# Altium schematic sheet JETSON_V2.SchDoc
size D; SheetNumber: 11; SheetTotal: 15
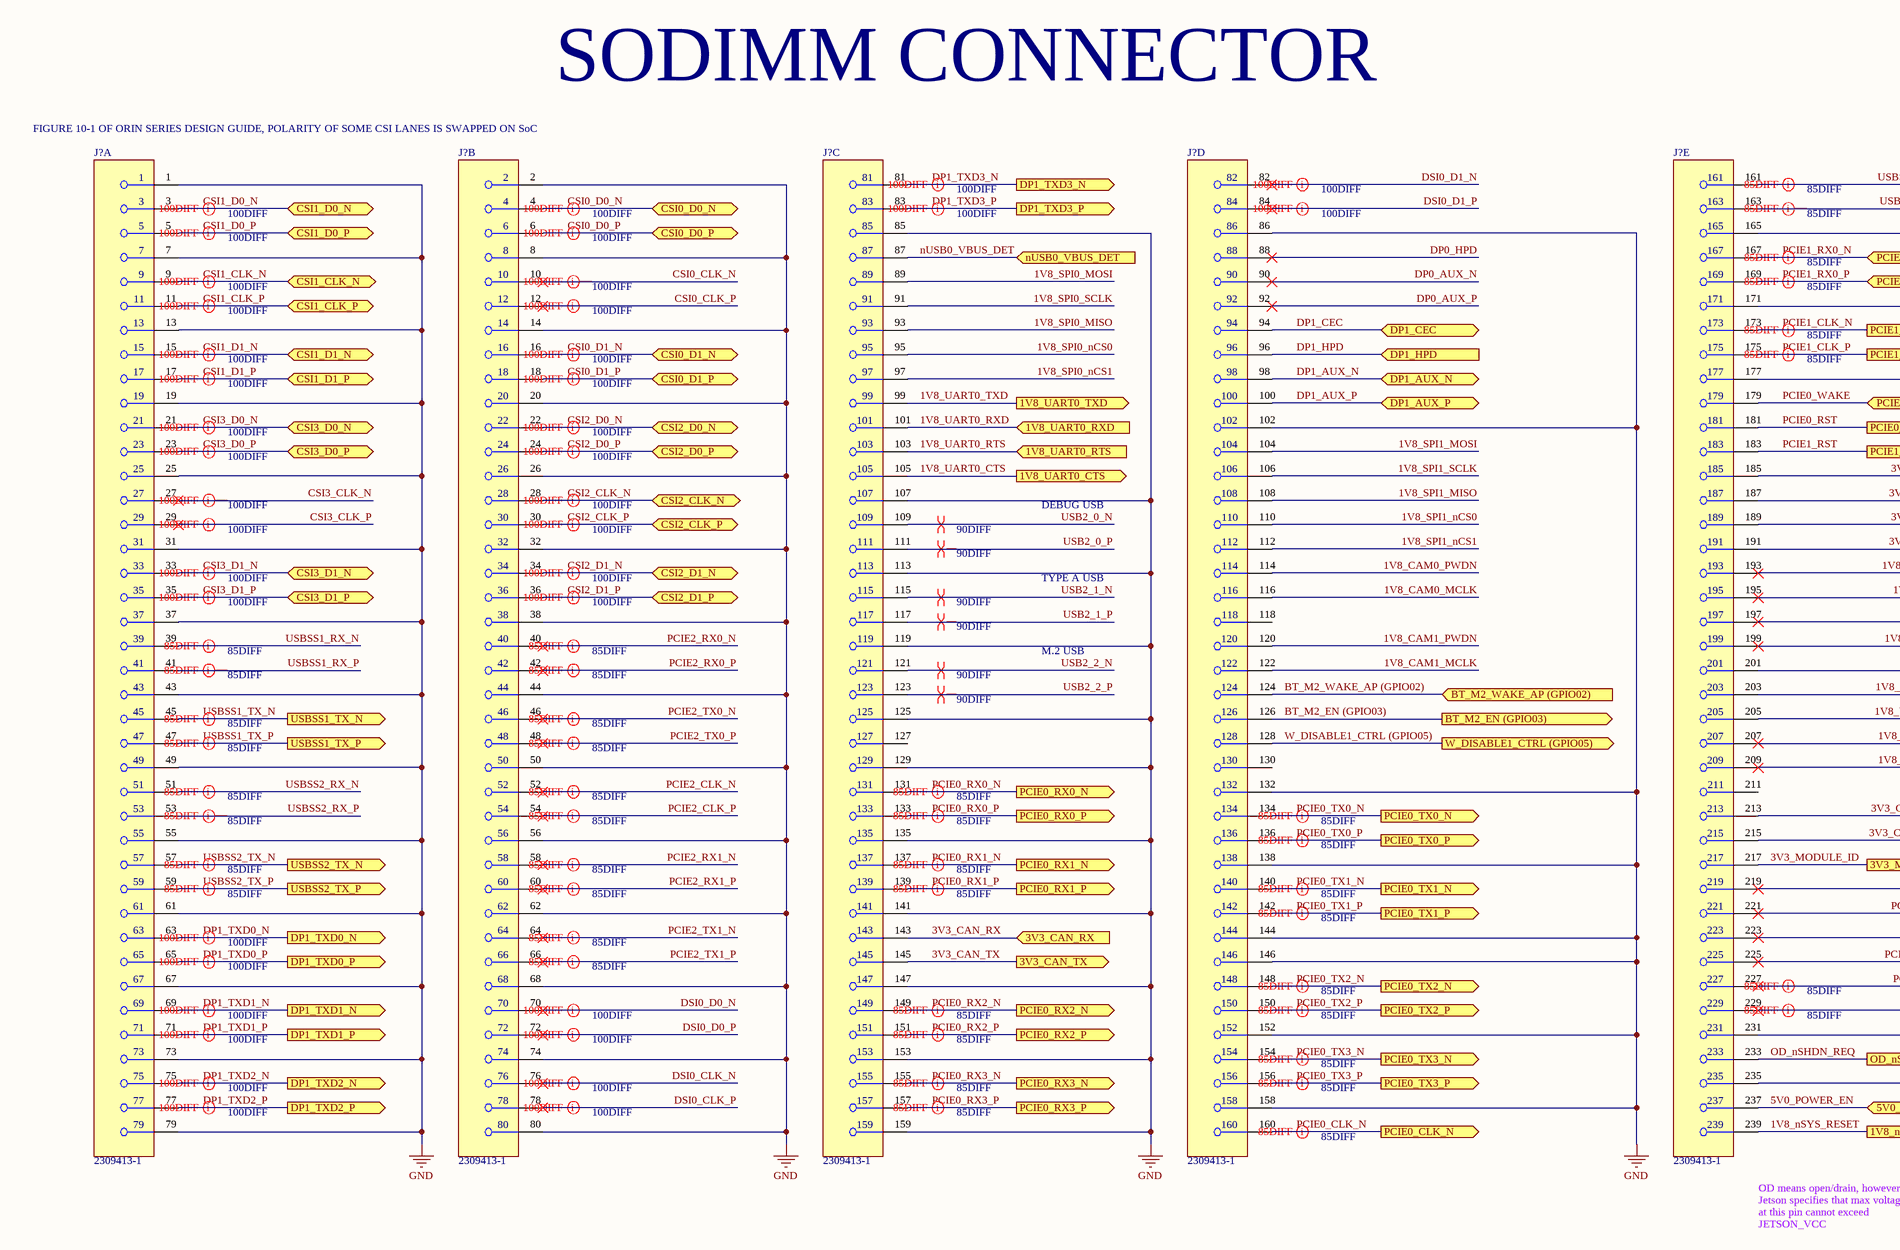
[diagram p0: JETSON_V2.SchDoc, top left]
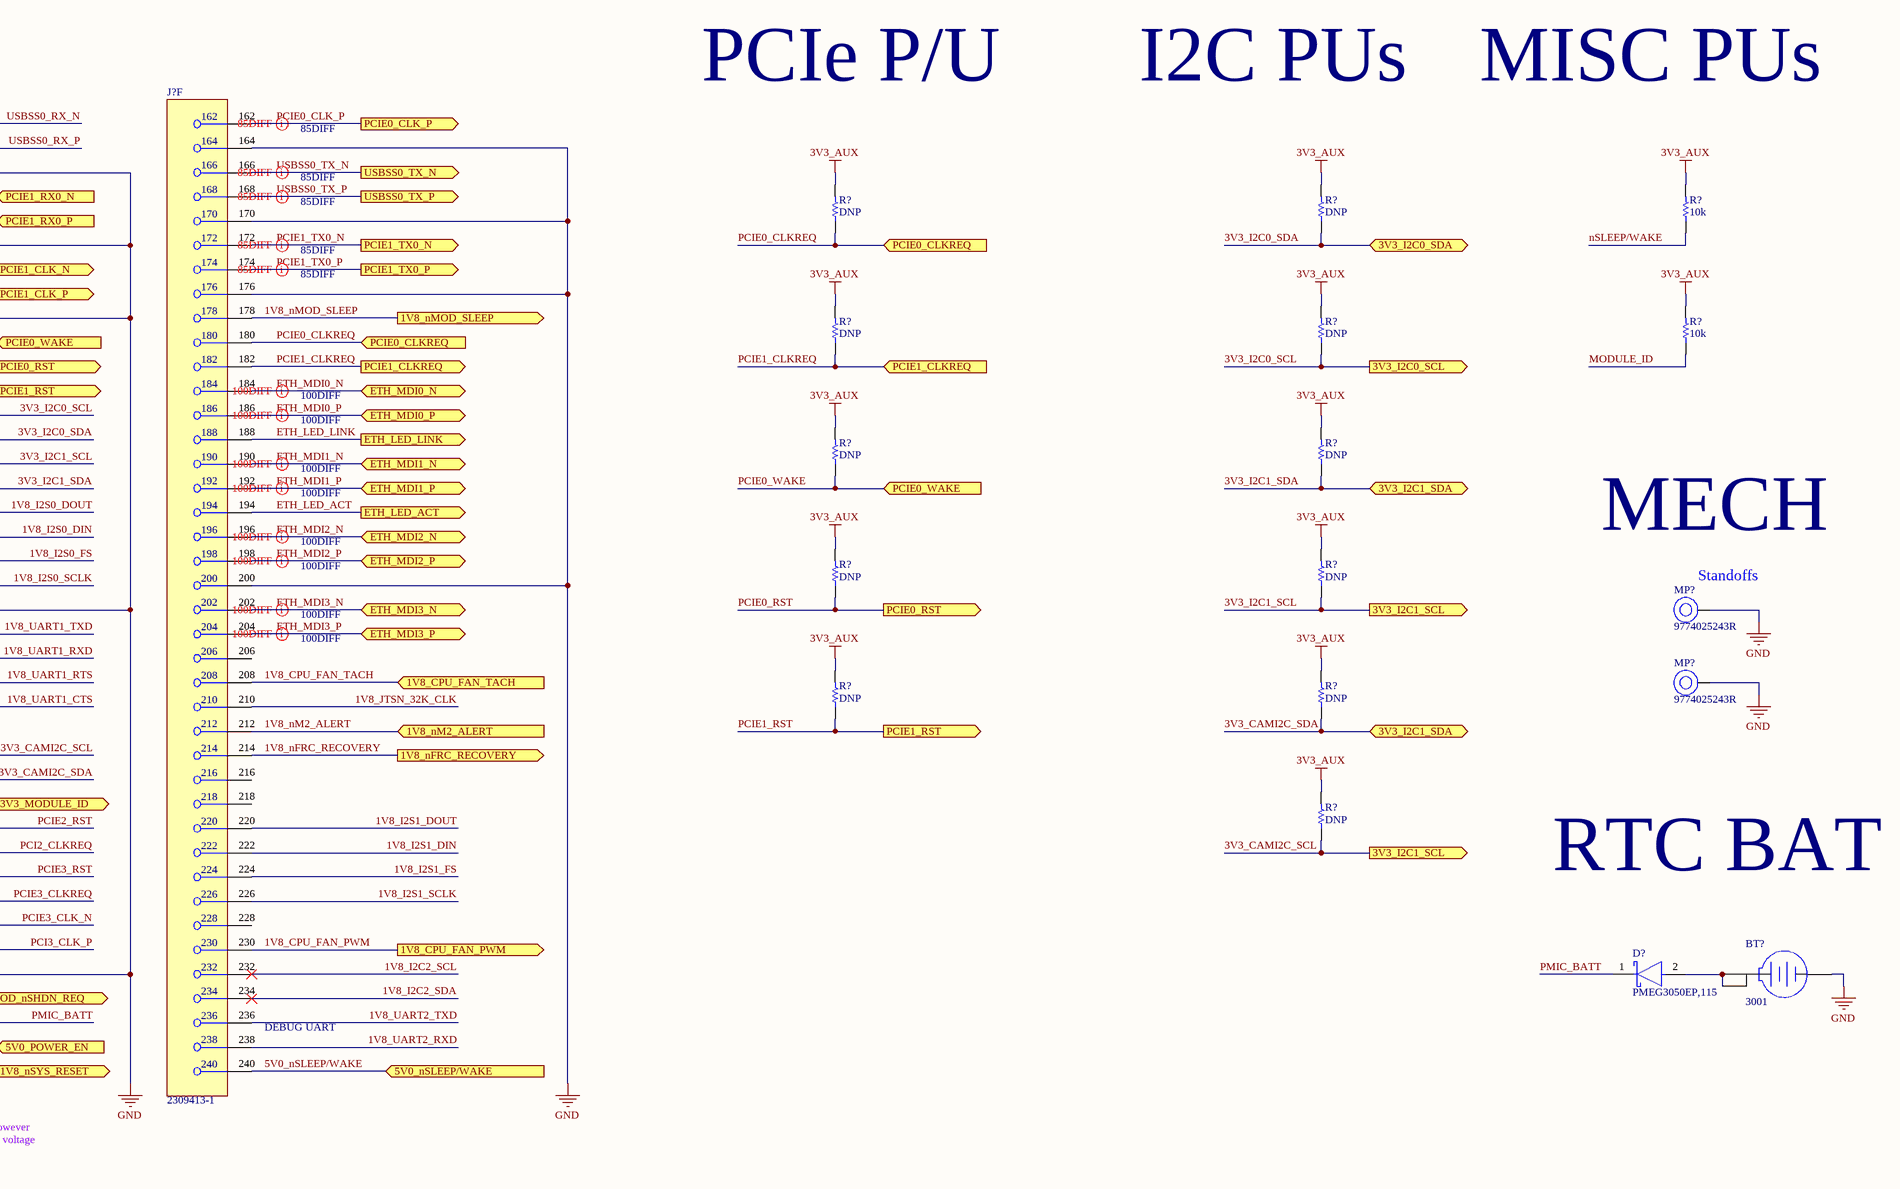
[diagram p1: JETSON_V2.SchDoc, top right]
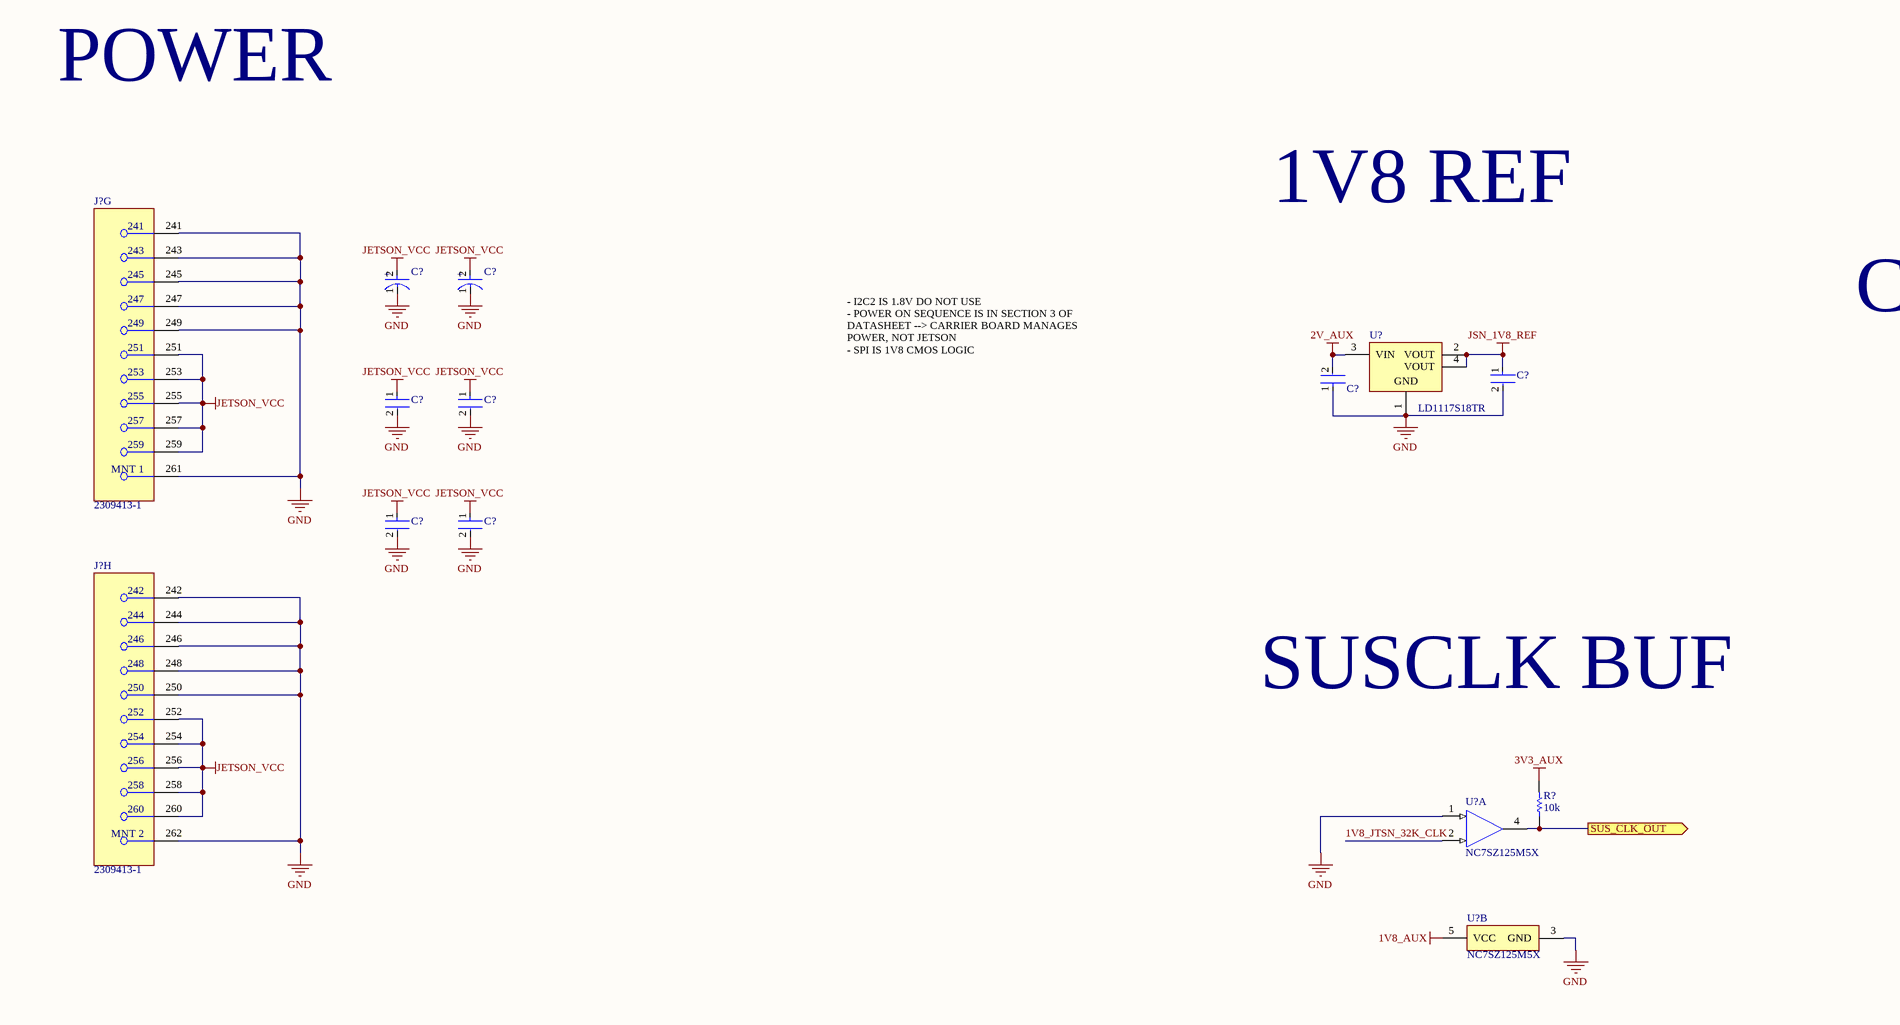
[diagram p2: JETSON_V2.SchDoc, bottom left]
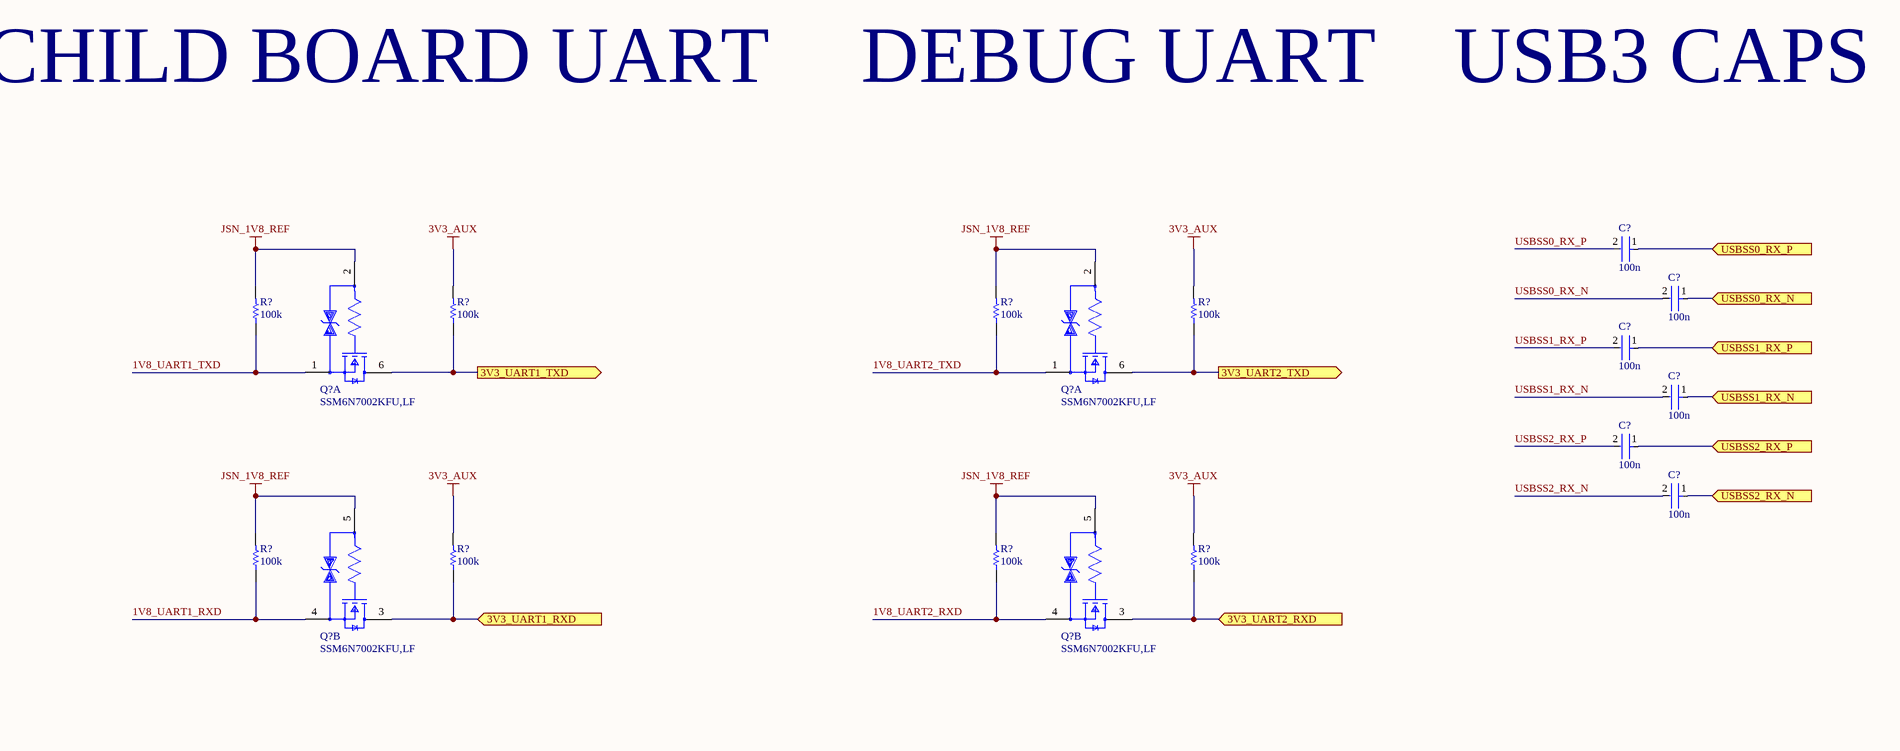
[diagram p3: JETSON_V2.SchDoc, bottom right]

## Parts
(Parts that share a designator on the sheet are numbered #1, #2 ... from top to bottom, then left to right.)
BT?  3001  [KSTN-3001_V]
C?#1  T491X107K025AT  [FP-T491X107K025AT-MFG]  (value not drawn)
C?#2  T491X107K025AT  [FP-T491X107K025AT-MFG]  (value not drawn)
C?#3  GRM188R60J106ME47D  [FP-GRM188-0_1-e0_2_0_55-IPC_A]  (value not drawn)
C?#4  12103D106KAT2A  [FP-1210-L_3_3_0_4-W_2_5_0-MFG]  (value not drawn)
C?#5  12103D106KAT2A  [FP-1210-L_3_3_0_4-W_2_5_0-MFG]  (value not drawn)
C?#6  C1005X7R1H104K050BB  [FP-C1005-050-0_05-IPC_C]  (value not drawn)
C?#7  100n  [FP-0402-L_1_0_0_05-W_0_5-IPC_A]
C?#8  12103D106KAT2A  [FP-1210-L_3_3_0_4-W_2_5_0-MFG]  (value not drawn)
C?#9  12103D106KAT2A  [FP-1210-L_3_3_0_4-W_2_5_0-MFG]  (value not drawn)
C?#10  100n  [FP-0402-L_1_0_0_05-W_0_5-IPC_A]
C?#11  100n  [FP-0402-L_1_0_0_05-W_0_5-IPC_A]
C?#12  100n  [FP-0402-L_1_0_0_05-W_0_5-IPC_A]
C?#13  100n  [FP-0402-L_1_0_0_05-W_0_5-IPC_A]
C?#14  100n  [FP-0402-L_1_0_0_05-W_0_5-IPC_A]
D?  PMEG3050EP,115  [FP-SOD128-MFG]
J?#1  2309413-1  [FP-2309413-1-MFG]  (part A of 8)
J?#2  2309413-1  [FP-2309413-1-MFG]  (part B of 8)
J?#3  2309413-1  [FP-2309413-1-MFG]  (part C of 8)
J?#4  2309413-1  [FP-2309413-1-MFG]  (part D of 8)
J?#5  2309413-1  [FP-2309413-1-MFG]  (part E of 8)
J?#6  2309413-1  [FP-2309413-1-MFG]  (part F of 8)
J?#7  2309413-1  [FP-2309413-1-MFG]  (part G of 8)
J?#8  2309413-1  [FP-2309413-1-MFG]  (part H of 8)
MP?#1  9774025243R  [9774025243]
MP?#2  9774025243R  [9774025243]
Q?#1  SSM6N7002KFU,LF  [FP-SSOP6-P-0_65A-MFG]  (part A of 2)
Q?#2  SSM6N7002KFU,LF  [FP-SSOP6-P-0_65A-MFG]  (part A of 2)
Q?#3  SSM6N7002KFU,LF  [FP-SSOP6-P-0_65A-MFG]  (part B of 2)
Q?#4  SSM6N7002KFU,LF  [FP-SSOP6-P-0_65A-MFG]  (part B of 2)
R?#1  DNP  [R0603B]
R?#2  DNP  [R0603B]
R?#3  10k  [R0603B]
R?#4  DNP  [R0603B]
R?#5  DNP  [R0603B]
R?#6  10k  [R0603B]
R?#7  DNP  [R0603B]
R?#8  DNP  [R0603B]
R?#9  DNP  [R0603B]
R?#10  DNP  [R0603B]
R?#11  DNP  [R0603B]
R?#12  DNP  [R0603B]
R?#13  DNP  [R0603B]
R?#14  100k  [R0603B]
R?#15  100k  [R0603B]
R?#16  100k  [R0603B]
R?#17  100k  [R0603B]
R?#18  100k  [R0603B]
R?#19  100k  [R0603B]
R?#20  100k  [R0603B]
R?#21  100k  [R0603B]
R?#22  10k  [R0603B]
U?#1  LD1117S18TR  [SOT-223_M]
U?#2  NC7SZ125M5X  [FAIR-SOT23-5_V]  (part A of 2)
U?#3  NC7SZ125M5X  [FAIR-SOT23-5_V]  (part B of 2)

## Ports
1V8_CPU_FAN_PWM (out), 1V8_CPU_FAN_TACH (in), 1V8_nFRC_RECOVERY (out), 1V8_nM2_ALERT (in), 1V8_nMOD_SLEEP (out), 1V8_nSYS_RESET (out), 1V8_UART0_CTS (out), 1V8_UART0_RTS (in), 1V8_UART0_RXD (in), 1V8_UART0_TXD (out), 3V3_CAN_RX (in), 3V3_CAN_TX (out), 3V3_I2C0_SCL (out), 3V3_I2C0_SDA (bidir), 3V3_I2C1_SCL (out), 3V3_I2C1_SDA (bidir), 3V3_MODULE_ID (out), 3V3_UART1_RXD (in), 3V3_UART1_TXD (out), 3V3_UART2_RXD (in), 3V3_UART2_TXD (out), 5V0_nSLEEP/WAKE (in), 5V0_POWER_EN (in), BT_M2_EN (GPIO03) (out), BT_M2_WAKE_AP (GPIO02) (in), CSI0_D0_N (bidir), CSI0_D0_P (bidir), CSI0_D1_N (bidir), CSI0_D1_P (bidir), CSI1_CLK_N (bidir), CSI1_CLK_P (bidir), CSI1_D0_N (bidir), CSI1_D0_P (bidir), CSI1_D1_N (bidir), CSI1_D1_P (bidir), CSI2_CLK_N (bidir), CSI2_CLK_P (bidir), CSI2_D0_N (bidir), CSI2_D0_P (bidir), CSI2_D1_N (bidir), CSI2_D1_P (bidir), CSI3_D0_N (bidir), CSI3_D0_P (bidir), CSI3_D1_N (bidir), CSI3_D1_P (bidir), DP1_AUX_N (bidir), DP1_AUX_P (bidir), DP1_CEC (bidir), DP1_HPD (in), DP1_TXD0_N (out), DP1_TXD0_P (out), DP1_TXD1_N (out), DP1_TXD1_P (out), DP1_TXD2_N (out), DP1_TXD2_P (out), DP1_TXD3_N (out), DP1_TXD3_P (out), ETH_LED_ACT (out), ETH_LED_LINK (out), ETH_MDI0_N (bidir), ETH_MDI0_P (bidir), ETH_MDI1_N (bidir), ETH_MDI1_P (bidir), ETH_MDI2_N (bidir), ETH_MDI2_P (bidir), ETH_MDI3_N (bidir), ETH_MDI3_P (bidir), nUSB0_VBUS_DET (in), OD_nSHDN_REQ (out), PCIE0_CLK_N (out), PCIE0_CLK_P (out), PCIE0_CLKREQ (in), PCIE0_RST (out), PCIE0_RX0_N (out), PCIE0_RX0_P (out), PCIE0_RX1_N (out), PCIE0_RX1_P (out), PCIE0_RX2_N (out), PCIE0_RX2_P (out), PCIE0_RX3_N (out), PCIE0_RX3_P (out), PCIE0_TX0_N (out), PCIE0_TX0_P (out), PCIE0_TX1_N (out), PCIE0_TX1_P (out), PCIE0_TX2_N (out), PCIE0_TX2_P (out), PCIE0_TX3_N (out), PCIE0_TX3_P (out), PCIE0_WAKE (in), PCIE1_CLK_N (out), PCIE1_CLK_P (out), PCIE1_CLKREQ (in), PCIE1_CLKREQ (out), PCIE1_RST (out), PCIE1_RX0_N (in), PCIE1_RX0_P (in), PCIE1_TX0_N (out), PCIE1_TX0_P (out), SUS_CLK_OUT (out), USBSS0_RX_N (in), USBSS0_RX_P (in), USBSS0_TX_N (out), USBSS0_TX_P (out), USBSS1_RX_N (in), USBSS1_RX_P (in), USBSS1_TX_N (out), USBSS1_TX_P (out), USBSS2_RX_N (in), USBSS2_RX_P (in), USBSS2_TX_N (out), USBSS2_TX_P (out), W_DISABLE1_CTRL (GPIO05) (out)

## Nets
1V8_AUX: U?#3.5(VCC)
2V_AUX: C?#6.2 U?#1.3(VIN)
3V3_AUX: R?#1.2 R?#2.2 R?#3.2 R?#4.2 R?#5.2 R?#6.2 R?#7.2 R?#8.2 R?#9.2 R?#10.2 R?#11.2 R?#12.2 R?#13.2 R?#15.2 R?#17.2 R?#19.2 R?#21.2 R?#22.2
GND: BT?.3(-) C?#1.1(C) C?#2.1(C) C?#3.2 C?#4.2 C?#5.2 C?#6.1 C?#8.2 C?#9.2 J?#1.1 J?#1.7 J?#1.13 J?#1.19 J?#1.25 J?#1.31 J?#1.37 J?#1.43 J?#1.49 J?#1.55 J?#1.61 J?#1.67 J?#1.73 J?#1.79 J?#2.2 J?#2.8 J?#2.14 J?#2.20 J?#2.26 J?#2.32 J?#2.38 J?#2.44 J?#2.50 J?#2.56 J?#2.62 J?#2.68 J?#2.74 J?#2.80 J?#3.85 J?#3.107 J?#3.113 J?#3.119 J?#3.125 J?#3.129 J?#3.135 J?#3.141 J?#3.147 J?#3.153 J?#3.159 J?#4.86 J?#4.102 J?#4.132 J?#4.138 J?#4.144 J?#4.146 J?#4.152 J?#4.158 J?#5.165 J?#5.171 J?#5.177 J?#5.201 J?#5.231 J?#6.164 J?#6.170 J?#6.176 J?#6.200 J?#7.241 J?#7.243 J?#7.245 J?#7.247 J?#7.249 J?#7.261(MNT_1) J?#8.242 J?#8.244 J?#8.246 J?#8.248 J?#8.250 J?#8.262(MNT_2) MP?#1.1 MP?#2.1 U?#1.1(GND) U?#2.1(~{OE}) U?#3.3(GND)
JETSON_VCC: C?#1.2(A) C?#2.2(A) C?#4.1 C?#5.1 C?#8.1 C?#9.1 J?#7.251 J?#7.253 J?#7.255 J?#7.257 J?#7.259 J?#8.252 J?#8.254 J?#8.256 J?#8.258 J?#8.260
JSN_1V8_REF: C?#3.1 Q?#1.2(Gate1) Q?#2.2(Gate1) Q?#3.5(Gate2) Q?#4.5(Gate2) R?#14.2 R?#16.2 R?#18.2 R?#20.2 U?#1.2(VOUT) U?#1.4(VOUT)
1V8_CAM0_MCLK: J?#4.116
1V8_CAM0_PWDN: J?#4.114
1V8_CAM1_MCLK: J?#4.122
1V8_CAM1_PWDN: J?#4.120
1V8_CPU_FAN_PWM: J?#6.230 ; port 1V8_CPU_FAN_PWM
1V8_CPU_FAN_TACH: J?#6.208 ; port 1V8_CPU_FAN_TACH
1V8_I2C2_SCL: J?#6.232
1V8_I2C2_SDA: J?#6.234
1V8_I2S0_DIN: J?#5.195
1V8_I2S0_DOUT: J?#5.193
1V8_I2S0_FS: J?#5.197
1V8_I2S0_SCLK: J?#5.199
1V8_I2S1_DIN: J?#6.222
1V8_I2S1_DOUT: J?#6.220
1V8_I2S1_FS: J?#6.224
1V8_I2S1_SCLK: J?#6.226
1V8_JTSN_32K_CLK: J?#6.210 U?#2.2(A)
1V8_nFRC_RECOVERY: J?#6.214 ; port 1V8_nFRC_RECOVERY
1V8_nM2_ALERT: J?#6.212 ; port 1V8_nM2_ALERT
1V8_nMOD_SLEEP: J?#6.178 ; port 1V8_nMOD_SLEEP
1V8_nSYS_RESET: J?#5.239 ; port 1V8_nSYS_RESET
1V8_SPI0_MISO: J?#3.93
1V8_SPI0_MOSI: J?#3.89
1V8_SPI0_nCS0: J?#3.95
1V8_SPI0_nCS1: J?#3.97
1V8_SPI0_SCLK: J?#3.91
1V8_SPI1_MISO: J?#4.108
1V8_SPI1_MOSI: J?#4.104
1V8_SPI1_nCS0: J?#4.110
1V8_SPI1_nCS1: J?#4.112
1V8_SPI1_SCLK: J?#4.106
1V8_UART0_CTS: J?#3.105 ; port 1V8_UART0_CTS
1V8_UART0_RTS: J?#3.103 ; port 1V8_UART0_RTS
1V8_UART0_RXD: J?#3.101 ; port 1V8_UART0_RXD
1V8_UART0_TXD: J?#3.99 ; port 1V8_UART0_TXD
1V8_UART1_CTS: J?#5.209
1V8_UART1_RTS: J?#5.207
1V8_UART1_RXD: J?#5.205 Q?#3.4(Source2) R?#18.1
1V8_UART1_TXD: J?#5.203 Q?#1.1(Source1) R?#14.1
1V8_UART2_RXD: J?#6.238 Q?#4.4(Source2) R?#20.1
1V8_UART2_TXD: J?#6.236 Q?#2.1(Source1) R?#16.1
3V3_CAMI2C_SCL: J?#5.189 J?#5.213 R?#10.1 R?#13.1 ; port 3V3_I2C1_SCL  [also labelled 3V3_I2C1_SCL]
3V3_CAMI2C_SDA: J?#5.191 J?#5.215 R?#8.1 R?#12.1 ; port 3V3_I2C1_SDA  [also labelled 3V3_I2C1_SDA]
3V3_CAN_RX: J?#3.143 ; port 3V3_CAN_RX
3V3_CAN_TX: J?#3.145 ; port 3V3_CAN_TX
3V3_I2C0_SCL: J?#5.185 R?#5.1 ; port 3V3_I2C0_SCL
3V3_I2C0_SDA: J?#5.187 R?#2.1 ; port 3V3_I2C0_SDA
3V3_MODULE_ID: J?#5.217 ; port 3V3_MODULE_ID
3V3_UART1_RXD: Q?#3.3(Drain2) R?#19.1 ; port 3V3_UART1_RXD
3V3_UART1_TXD: Q?#1.6(Drain1) R?#15.1 ; port 3V3_UART1_TXD
3V3_UART2_RXD: Q?#4.3(Drain2) R?#21.1 ; port 3V3_UART2_RXD
3V3_UART2_TXD: Q?#2.6(Drain1) R?#17.1 ; port 3V3_UART2_TXD
5V0_nSLEEP/WAKE: J?#6.240 ; port 5V0_nSLEEP/WAKE
5V0_POWER_EN: J?#5.237 ; port 5V0_POWER_EN
BT_M2_EN (GPIO03): J?#4.126 ; port BT_M2_EN (GPIO03)
BT_M2_WAKE_AP (GPIO02): J?#4.124 ; port BT_M2_WAKE_AP (GPIO02)
CSI0_CLK_N: J?#2.10
CSI0_CLK_P: J?#2.12
CSI0_D0_N: J?#2.4 ; port CSI0_D0_N
CSI0_D0_P: J?#2.6 ; port CSI0_D0_P
CSI0_D1_N: J?#2.16 ; port CSI0_D1_N
CSI0_D1_P: J?#2.18 ; port CSI0_D1_P
CSI1_CLK_N: J?#1.9 ; port CSI1_CLK_N
CSI1_CLK_P: J?#1.11 ; port CSI1_CLK_P
CSI1_D0_N: J?#1.3 ; port CSI1_D0_N
CSI1_D0_P: J?#1.5 ; port CSI1_D0_P
CSI1_D1_N: J?#1.15 ; port CSI1_D1_N
CSI1_D1_P: J?#1.17 ; port CSI1_D1_P
CSI2_CLK_N: J?#2.28 ; port CSI2_CLK_N
CSI2_CLK_P: J?#2.30 ; port CSI2_CLK_P
CSI2_D0_N: J?#2.22 ; port CSI2_D0_N
CSI2_D0_P: J?#2.24 ; port CSI2_D0_P
CSI2_D1_N: J?#2.34 ; port CSI2_D1_N
CSI2_D1_P: J?#2.36 ; port CSI2_D1_P
CSI3_CLK_N: J?#1.27
CSI3_CLK_P: J?#1.29
CSI3_D0_N: J?#1.21 ; port CSI3_D0_N
CSI3_D0_P: J?#1.23 ; port CSI3_D0_P
CSI3_D1_N: J?#1.33 ; port CSI3_D1_N
CSI3_D1_P: J?#1.35 ; port CSI3_D1_P
DP0_AUX_N: J?#4.90
DP0_AUX_P: J?#4.92
DP0_HPD: J?#4.88
DP1_AUX_N: J?#4.98 ; port DP1_AUX_N
DP1_AUX_P: J?#4.100 ; port DP1_AUX_P
DP1_CEC: J?#4.94 ; port DP1_CEC
DP1_HPD: J?#4.96 ; port DP1_HPD
DP1_TXD0_N: J?#1.63 ; port DP1_TXD0_N
DP1_TXD0_P: J?#1.65 ; port DP1_TXD0_P
DP1_TXD1_N: J?#1.69 ; port DP1_TXD1_N
DP1_TXD1_P: J?#1.71 ; port DP1_TXD1_P
DP1_TXD2_N: J?#1.75 ; port DP1_TXD2_N
DP1_TXD2_P: J?#1.77 ; port DP1_TXD2_P
DP1_TXD3_N: J?#3.81 ; port DP1_TXD3_N
DP1_TXD3_P: J?#3.83 ; port DP1_TXD3_P
DSI0_CLK_N: J?#2.76
DSI0_CLK_P: J?#2.78
DSI0_D0_N: J?#2.70
DSI0_D0_P: J?#2.72
DSI0_D1_N: J?#4.82
DSI0_D1_P: J?#4.84
ETH_LED_ACT: J?#6.194 ; port ETH_LED_ACT
ETH_LED_LINK: J?#6.188 ; port ETH_LED_LINK
ETH_MDI0_N: J?#6.184 ; port ETH_MDI0_N
ETH_MDI0_P: J?#6.186 ; port ETH_MDI0_P
ETH_MDI1_N: J?#6.190 ; port ETH_MDI1_N
ETH_MDI1_P: J?#6.192 ; port ETH_MDI1_P
ETH_MDI2_N: J?#6.196 ; port ETH_MDI2_N
ETH_MDI2_P: J?#6.198 ; port ETH_MDI2_P
ETH_MDI3_N: J?#6.202 ; port ETH_MDI3_N
ETH_MDI3_P: J?#6.204 ; port ETH_MDI3_P
MODULE_ID: R?#6.1
nSLEEP/WAKE: R?#3.1
nUSB0_VBUS_DET: J?#3.87 ; port nUSB0_VBUS_DET
OD_nSHDN_REQ: J?#5.233 ; port OD_nSHDN_REQ
PCI2_CLKREQ: J?#5.221
PCI3_CLK_P: J?#5.229
PCIE0_CLK_N: J?#4.160 ; port PCIE0_CLK_N
PCIE0_CLK_P: J?#6.162 ; port PCIE0_CLK_P
PCIE0_CLKREQ: J?#6.180 R?#1.1 ; port PCIE0_CLKREQ
PCIE0_RST: J?#5.181 R?#9.1 ; port PCIE0_RST
PCIE0_RX0_N: J?#3.131 ; port PCIE0_RX0_N
PCIE0_RX0_P: J?#3.133 ; port PCIE0_RX0_P
PCIE0_RX1_N: J?#3.137 ; port PCIE0_RX1_N
PCIE0_RX1_P: J?#3.139 ; port PCIE0_RX1_P
PCIE0_RX2_N: J?#3.149 ; port PCIE0_RX2_N
PCIE0_RX2_P: J?#3.151 ; port PCIE0_RX2_P
PCIE0_RX3_N: J?#3.155 ; port PCIE0_RX3_N
PCIE0_RX3_P: J?#3.157 ; port PCIE0_RX3_P
PCIE0_TX0_N: J?#4.134 ; port PCIE0_TX0_N
PCIE0_TX0_P: J?#4.136 ; port PCIE0_TX0_P
PCIE0_TX1_N: J?#4.140 ; port PCIE0_TX1_N
PCIE0_TX1_P: J?#4.142 ; port PCIE0_TX1_P
PCIE0_TX2_N: J?#4.148 ; port PCIE0_TX2_N
PCIE0_TX2_P: J?#4.150 ; port PCIE0_TX2_P
PCIE0_TX3_N: J?#4.154 ; port PCIE0_TX3_N
PCIE0_TX3_P: J?#4.156 ; port PCIE0_TX3_P
PCIE0_WAKE: J?#5.179 R?#7.1 ; port PCIE0_WAKE
PCIE1_CLK_N: J?#5.173 ; port PCIE1_CLK_N
PCIE1_CLK_P: J?#5.175 ; port PCIE1_CLK_P
PCIE1_CLKREQ: J?#6.182 R?#4.1 ; port PCIE1_CLKREQ
PCIE1_RST: J?#5.183 R?#11.1 ; port PCIE1_RST
PCIE1_RX0_N: J?#5.167 ; port PCIE1_RX0_N
PCIE1_RX0_P: J?#5.169 ; port PCIE1_RX0_P
PCIE1_TX0_N: J?#6.172 ; port PCIE1_TX0_N
PCIE1_TX0_P: J?#6.174 ; port PCIE1_TX0_P
PCIE2_CLK_N: J?#2.52
PCIE2_CLK_P: J?#2.54
PCIE2_RST: J?#5.219
PCIE2_RX0_N: J?#2.40
PCIE2_RX0_P: J?#2.42
PCIE2_RX1_N: J?#2.58
PCIE2_RX1_P: J?#2.60
PCIE2_TX0_N: J?#2.46
PCIE2_TX0_P: J?#2.48
PCIE2_TX1_N: J?#2.64
PCIE2_TX1_P: J?#2.66
PCIE3_CLK_N: J?#5.227
PCIE3_CLKREQ: J?#5.225
PCIE3_RST: J?#5.223
PMIC_BATT: D?.1(C) J?#5.235
SUS_CLK_OUT: R?#22.1 U?#2.4(Y) ; port SUS_CLK_OUT
USB2_0_N: J?#3.109
USB2_0_P: J?#3.111
USB2_1_N: J?#3.115
USB2_1_P: J?#3.117
USB2_2_N: J?#3.121
USB2_2_P: J?#3.123
USBSS0_RX_N: C?#10.2 J?#5.161
USBSS0_RX_N: C?#10.1 ; port USBSS0_RX_N  [a separate net that carries the same name]
USBSS0_RX_P: C?#7.2 J?#5.163
USBSS0_RX_P: C?#7.1 ; port USBSS0_RX_P  [a separate net that carries the same name]
USBSS0_TX_N: J?#6.166 ; port USBSS0_TX_N
USBSS0_TX_P: J?#6.168 ; port USBSS0_TX_P
USBSS1_RX_N: C?#12.2 J?#1.39
USBSS1_RX_N: C?#12.1 ; port USBSS1_RX_N  [a separate net that carries the same name]
USBSS1_RX_P: C?#11.2 J?#1.41
USBSS1_RX_P: C?#11.1 ; port USBSS1_RX_P  [a separate net that carries the same name]
USBSS1_TX_N: J?#1.45 ; port USBSS1_TX_N
USBSS1_TX_P: J?#1.47 ; port USBSS1_TX_P
USBSS2_RX_N: C?#14.2 J?#1.51
USBSS2_RX_N: C?#14.1 ; port USBSS2_RX_N  [a separate net that carries the same name]
USBSS2_RX_P: C?#13.2 J?#1.53
USBSS2_RX_P: C?#13.1 ; port USBSS2_RX_P  [a separate net that carries the same name]
USBSS2_TX_N: J?#1.57 ; port USBSS2_TX_N
USBSS2_TX_P: J?#1.59 ; port USBSS2_TX_P
W_DISABLE1_CTRL (GPIO05): J?#4.128 ; port W_DISABLE1_CTRL (GPIO05)
NetBT?_1: BT?.1(+) BT?.2(+) D?.2(A)

Not connected (* = marked no-connect by the designer): J?#3 127; J?#4 118 130; J?#5 211; J?#6 206 216 218 228

## Layout directives
differential pair; differential pair class 90DIFF: USB2_0_N, USB2_0_P, USB2_1_N, USB2_1_P, USB2_2_N, USB2_2_P
differential pair; differential pair class 100DIFF: CSI0_CLK_N, CSI0_CLK_P, CSI0_D0_N, CSI0_D0_P, CSI0_D1_N, CSI0_D1_P, CSI1_CLK_N, CSI1_CLK_P, CSI1_D0_N, CSI1_D0_P, CSI1_D1_N, CSI1_D1_P, CSI2_CLK_N, CSI2_CLK_P, CSI2_D0_N, CSI2_D0_P, CSI2_D1_N, CSI2_D1_P, CSI3_CLK_N, CSI3_CLK_P, CSI3_D0_N, CSI3_D0_P, CSI3_D1_N, CSI3_D1_P, DP1_TXD0_N, DP1_TXD0_P, DP1_TXD1_N, DP1_TXD1_P, DP1_TXD2_N, DP1_TXD2_P, DP1_TXD3_N, DP1_TXD3_P, DSI0_CLK_N, DSI0_CLK_P, DSI0_D0_N, DSI0_D0_P, DSI0_D1_N, DSI0_D1_P, ETH_MDI0_N, ETH_MDI0_P, ETH_MDI1_N, ETH_MDI1_P, ETH_MDI2_N, ETH_MDI2_P, ETH_MDI3_N, ETH_MDI3_P
differential pair; differential pair class 85DIFF: PCI3_CLK_P, PCIE0_CLK_N, PCIE0_CLK_P, PCIE0_RX0_N, PCIE0_RX0_P, PCIE0_RX1_N, PCIE0_RX1_P, PCIE0_RX2_N, PCIE0_RX2_P, PCIE0_RX3_N, PCIE0_RX3_P, PCIE0_TX0_N, PCIE0_TX0_P, PCIE0_TX1_N, PCIE0_TX1_P, PCIE0_TX2_N, PCIE0_TX2_P, PCIE0_TX3_N, PCIE0_TX3_P, PCIE1_CLK_N, PCIE1_CLK_P, PCIE1_RX0_N, PCIE1_RX0_P, PCIE1_TX0_N, PCIE1_TX0_P, PCIE2_CLK_N, PCIE2_CLK_P, PCIE2_RX0_N, PCIE2_RX0_P, PCIE2_RX1_N, PCIE2_RX1_P, PCIE2_TX0_N, PCIE2_TX0_P, PCIE2_TX1_N, PCIE2_TX1_P, PCIE3_CLK_N, USBSS0_RX_N, USBSS0_RX_P, USBSS0_TX_N, USBSS0_TX_P, USBSS1_RX_N, USBSS1_RX_P, USBSS1_TX_N, USBSS1_TX_P, USBSS2_RX_N, USBSS2_RX_P, USBSS2_TX_N, USBSS2_TX_P

## Notes on the sheet
- FIGURE 10-1 OF ORIN SERIES DESIGN GUIDE, POLARITY OF SOME CSI LANES IS SWAPPED ON SoC
- SODIMM CONNECTOR
- PCIe P/U
- I2C PUs
- MISC PUs
- DEBUG USB
- TYPE A USB
- MECH
- M.2 USB
- (near MP?#1) Standoffs
- RTC BAT
- (near J?#6) DEBUG UART
- OD means open/drain, however Jetson specifies that max voltage at this pin cannot exceed JETSON_VCC
- POWER
- 1V8 REF
- CHILD BOARD UART
- DEBUG UART
- USB3 CAPS
- - I2C2 IS 1.8V DO NOT USE
  - POWER ON SEQUENCE IS IN SECTION 3 OF DATASHEET --> CARRIER BOARD MANAGES POWER, NOT JETSON
  - SPI IS 1V8 CMOS LOGIC
- SUSCLK BUF
- (in symbol CMP-2000-07204-2) +

## Library data of the parts
BT? = CMP-2000-05463-1: Holder Battery Coin, 12 mm, 2-Pin THD, RoHS; Manufacturer: Keystone; Package Reference: 3001; Package Description: 2-Pin Through Hole Device, Body 13.21 x 12.07 mm; Datasheet Version: Rev. H, 09/2006; Datasheet URL: https://datasheet.ciiva.com/3/3001-3954.pdf; Mounting Technology: ThroughHole; Manufacturer URL: http://www.keyelco.com/
C?#1 C?#2 = CMP-2000-07204-2: CAP TANT 100UF 10% 25V 2917; Leakage Current: 25uA; Ripple Current: 742mA; Polarity: Polar; Dissipation Factor: 8%; Life (Hours): 2000Hour; Dielectric Material: Tantalum; ESR (Equivalent Series Resistance): 300mR; Length: 7.3mm; RoHS Compliant: No; Failure Rate: 0.001%; REACH SVHC: No SVHC; Tolerance: 10%; Mount: Surface Mount; Height - Seated (Max): 0.169inch; Features: General Purpose; Height: 4mm; Package Quantity: 1; Case Code (Metric): 7343; Max Operating Temperature: 125°C; Number of Pins: 2; Radiation Hardening: No; Lead Free: Lead Free; Capacitance: 100uF; Termination: SMD/SMT; Voltage Rating: 25V; Series: T491; Depth: 4.3mm; Construction: Flat; Case/Package: 2917; Min Operating Temperature: -55°C; Voltage Rating (DC): 25V; Width: 4.3mm; Packaging: Tape and Reel; Case Code (Imperial): 2917; Voltage: 25V
C?#3 = CMP-2006-02792-2: Chip Multilayer Ceramic Capacitors for General Purpose, 0603, 10uF, X5R, 15%, 20%, 6.3V; Packaging: Tape and Reel; Voltage Rating (DC): 6.3V; Width: 0.031inch; Termination: SMD/SMT; Dielectric: X5R; Package Quantity: 4000; Voltage Rating: 6.3V; Capacitance: 10uF; Case/Package: 0603; Min Operating Temperature: -55°C; Voltage: 6.3V; Length: 1.6mm; Thickness: 0.035inch; Lead Free: Lead Free; Depth: 0.8mm; Case Code (Imperial): 0603; Max Operating Temperature: 85°C; Material: Ceramic; Height: 0.8mm; Tolerance: 20%; Mount: Surface Mount; REACH SVHC: No SVHC; Radiation Hardening: No; Case Code (Metric): 1608
C?#4 C?#5 C?#8 C?#9 = CMP-2000-05477-2: General Purpose Ceramic Capacitor, 1210, 10uF, 10%, X5R, 15%, 25V; Lead Free: Lead Free; Max Operating Temperature: 85°C; REACH SVHC: No SVHC; Depth: 2.5mm; Packaging: Tape and Reel; Min Operating Temperature: -55°C; Height: 2.29mm; Construction: Flat; Case Code (Imperial): 1210; Radiation Hardening: No; Voltage: 25V; Case/Package: 1210; Series: -; Dielectric: X5R; Length: 3.2mm; Thickness: 0.11inch; Package Quantity: 1; Termination: SMD/SMT; Case Code (Metric): 3225; Voltage Rating (DC): 25V; Voltage Rating: 25V; Contact Plating: Tin; RoHS Compliant: Yes; Mount: Surface Mount; Width: 0.098inch; Capacitance: 10uF; Tolerance: 10%
C?#6 = CMP-2000-05393-2: Multilayer Ceramic Capacitors 100nF ±10% 50V X7R SMD 0402; Voltage: 50V; Dielectric Material: Ceramic; Min Operating Temperature: -55°C; Depth: 0.5mm; Radiation Hardening: No; RoHS Compliant: Yes; Voltage Rating (DC): 50V; Lead Free: Lead Free; Resistor Type: Ceramic; Height: 0.5mm; Dielectric: X7R; Thickness: 0.022inch; Case/Package: 0402; Case Code (Metric): 1005; Termination: SMD/SMT; Capacitance: 100nF; Packaging: Tape and Reel; Max Operating Temperature: 125°C; Mount: Surface Mount; Package Quantity: 1; Width: 0.02inch; Weight: 2.3E-05oz; Voltage Rating: 50V; Tolerance: 10%; Construction: Flat; Case Code (Imperial): 0402; Length: 1mm; REACH SVHC: No SVHC; Series: C
C?#7 C?#10-C?#14 = CMP-001-00058-1: LARGE PADS, 0402 CAP, CHANGE COMMENT TO MATCH REAL P/N; Capacitor Type: Ceramic; Min Operating Temperature: -55°C; Mounting Technology: Surface Mount; Pins: 2; Case/Package: 0402; RoHS Compliant: Yes; Max Operating Temperature: 85°C
D? = CMP-14398-000051-1: DIODE SCHOTTKY 30V 5A SOD128; RoHS Compliant: Yes
J?#1-J?#8 = CMP-03356-000001-1: DDR4 SODIMM 260P 9.2H STD; Manufacturer: TE Connectivity; Voltage Rating: 25V; Current Rating: 0.5A; Is Female: yes; Pitch: 0.5mm; Memory Type: SDRAM,DDR; Conn Orientation: Horizontal; Number Of Contacts: 260; Temperature: -55°C to +85°C; Octopart: https://octopart.com/2309413-1-te+connectivity-84799194; Device Class L3: unset; Contact Material: Gold,Nickel; ComponentLink2URL: https://www.te.com/commerce/DocumentDelivery/DDEController?Action=showdoc&DocId=Specification+Or+Standard%7F108-115122%7FA1%7Fpdf%7FEnglish%7FENG_SS_108-115122_A1.pdf%7F2309413-1; Manufacturer Part Number: 2309413-1; ComponentLink2Description: Datasheet; Digikey Description: DDR4 SODIMM 260P 9.2H STD; Height: 18.8mm; Footprint Url: https://www.te.com/commerce/DocumentDelivery/DDEController?Action=showdoc&DocId=Customer+Drawing%7F2309413%7F4%7Fpdf%7FEnglish%7FENG_CD_2309413_4.pdf%7F2309413-1; Temperature Range Low: -55°C; Device Class L2: Memory Connectors; Temperature Range High: +85°C; RoHS: TRUE; Automotive: No; Device Class L1: Connectors; Mouser Description: Conn DDR4 DIMM Socket SKT 260 POS 0.5mm Solder RA SMD T/R; Category: Conn; Package: 0; Lead Free: Yes
MP?#1 MP?#2 = CMP-03913-59774857-1: 9774025243R Spacer Material: Steel, Tin-Plated Mounting: SMT Series: WA-SMST Thread D: M2; Outside Diameter: 4.3434mm; Threaded/Unthreaded: Threaded; Plating: Tin; REACH SVHC: Unknown; NexarPartId: 59774857; RoHS: Compliant; Material: Steel; Packaging: Tape and Reel; Max Operating Temperature: 150°C; Min Operating Temperature: -55°C; Length: 2.5mm; Height: 2.5mm
Q?#1-Q?#4 = CMP-35916-000009-1: MOSFET 2N-CH 60V 0.3A; Input Capacitance: 40pF; Continuous Drain Current (ID): 300mA; Max Power Dissipation: 285mW; FET Type: 2 N-Channel; Rds On Max: 1.5R; Mount: Surface Mount; Drain to Source Voltage (Vdss): 60V; Packaging: Tape and Reel
R?#1-R?#22 = CMP-009-00002-14: Resistor
U?#1 = CMP-0244-00308-1: Fixed Low Drop Positive Voltage Regulator, 1.8V, 4-Pin SOT-223, Tape and Reel; ComponentLink1URL: http://www.st.com; PackageReference: SOT-223; PackageDescription: 4-Pin SOT-223 Package, 6.5 x 3.5 mm Body, 2.3 mm Pitch, 7 mm Lead Span; ComponentLink2URL: http://www.st.com/internet/com/TECHNICAL_RESOURCES/TECHNICAL_LITERATURE/DATASHEET/CD00000544.pdf; ComponentLink2Description: Datasheet; ComponentLink1Description: Manufacturer URL; DatasheetVersion: 1/11/2011; PackageVersion: 2010
U?#2 U?#3 = CMP-2000-06816-1: TinyLogic UHS Buffer with Three-State Output, 1.65 to 5.5 V, -40 to 85 degC, 5-Pin SOT23, RoHS, Tape and Reel; Manufacturer: Fairchild Semiconductor; Input Signal Type: Single-Ended; Maximum Operating Supply Voltage: 5.5V; Number of Outputs per Chip: 1; Maximum Propagation Delay Time @ Maximum CL: 5.7@3.3V; Minimum Operating Supply Voltage: 1.65V; Maximum Quiescent Current: 2uA; Propagation Delay Test Condition: 50pF; Lead Finish: MatteTin; Number of Output Enables per Chip: 1Low; Maximum Low Level Output Current: 32mA; Output Type: 3-State; Package Version: 08/2015; Max Processing Temp: 260; Maximum High Level Output Current: -32mA; Tolerant I/Os: 5V; Bus Hold: No; Fabrication Technology: CMOS; Polarity: Non-Inverting; Typical Operating Supply Voltage: 1.8; Logic Function: Buffer/LineDriver; Manufacturer URL: https://www.fairchildsemi.com/; Mounting: SurfaceMount; Number of Channels per Chip: 1; Package Description: 5-Pin Small Outline Transistor, Body 2.9 x 1.6 mm, Pitch 0.95 mm; Package Reference: SOT23-5; Number of Elements per Chip: 1; Package URL: https://www.fairchildsemi.com/package-drawings/MA/MA05B.pdf; Datasheet URL: https://www.fairchildsemi.com/datasheets/NC/NC7SZ125.pdf; Datasheet Version: Rev. 1.0.5, 01/2014; Mounting Technology: SurfaceMount; Operating Temperature: -40to85C; Number of Inputs per Chip: 1